# Altium schematic sheet Motion-Sensor-Sheet.SchDoc
size A4; DocumentNumber: 5; SheetNumber: 5; SheetTotal: 8
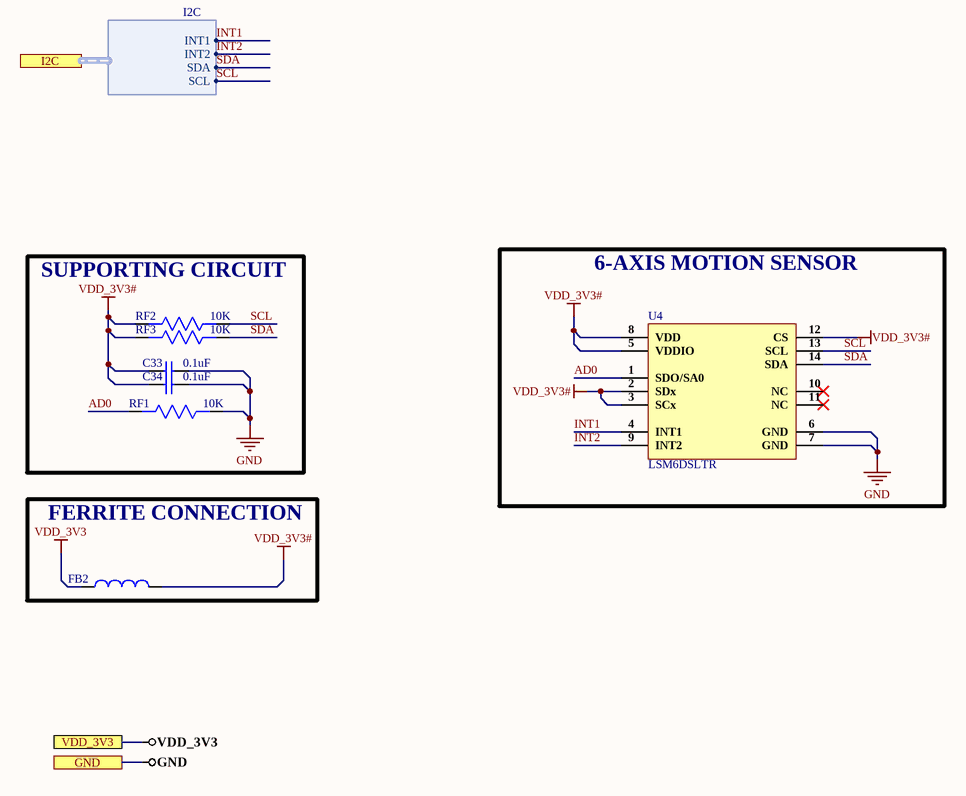
[diagram p0: Motion-Sensor-Sheet.SchDoc]

## Parts
C33  0.1uF  [Cap0603]
C34  0.1uF  [Cap0603]
FB2  MPZ1608S121ATDH5  [MPZ1608S121ATDH5]  (value not drawn)
RF1  10K  [Res0603]
RF2  10K  [Res0603]
RF3  10K  [Res0603]
U4  LSM6DSLTR  [14 LGA (2.5x3)]

## Blocks framed on the sheet
SUPPORTING CIRCUIT: C33 C34 RF1-RF3
6-AXIS MOTION SENSOR: U4
FERRITE CONNECTION: FB2

## Ports
GND, I2C (harness I2C), VDD_3V3

## Harnesses
I2C: INT1, INT2, SDA, SCL

## Nets
GND: C33.2 C34.2 RF1.1 U4.6(GND) U4.7(GND) ; port GND
VDD_3V3: FB2.1 ; port VDD_3V3
VDD_3V3#: C33.1 C34.1 FB2.2 RF2.2 RF3.2 U4.2(SDx) U4.3(SCx) U4.5(VDDIO) U4.8(VDD) U4.12(CS)
AD0: RF1.2 U4.1(SDO/SA0)
INT1: U4.4(INT1) ; port I2C.INT1
INT2: U4.9(INT2) ; port I2C.INT2
SCL: RF2.1 U4.13(SCL) ; port I2C.SCL
SDA: RF3.1 U4.14(SDA) ; port I2C.SDA

Not connected (* = marked no-connect by the designer): U4 10(NC)* 11(NC)*

## Library data of the parts
C33 C34 = CL10B104KB8NNNC: Cap Ceramic 0.1uF 50VDC X7R 10% SMD 0603 Paper T/R; Manufacturer: Samsung; Capacitance: 100nF; Voltage Rating: 50V; Supplier 1: Digi-Key; Manufacturer Part Number: CL10B104KB8NNNC; RoHS: Yes; Category: Ceramic Capacitors; Stock 1: 3998791; Pricing 1: 1=0.10000, 10=0.03000, 50=0.01640, 100=0.01340, 500=0.00954, 1000=0.00750 (USD); Mount: Surface Mount; Case/Package: 0603; Case Code (Metric): 1608; Case Code (Imperial): 0603; Material: Ceramic; Contact Plating: Tin; Min Operating Temperature: -55°C; Max Operating Temperature: 125°C; Dielectric: X7R; Tolerance: 10%; Package Quantity: 1; Packaging: Tape and Reel; Voltage: 50V; Voltage Rating (DC): 50V; Series: CL; Construction: Flat; Length: 1.6mm; Width: 0.031inch; Height: 0.8mm; Depth: 0.8mm; Thickness: 0.035inch; Radiation Hardening: No; Lead Free: Lead Free; RoHS Compliant: Yes; ComponentLink1URL: https://datasheet.ciiva.com/25803/cl10b104kb8nnnc-25803393.pdf?src-supplier=Digi-Key; ComponentLink1Description: https://datasheet.ciiva.com/25803/cl10b104kb8nnnc-25803393.pdf?src-supplier=Digi-Key; ComponentLink2URL: https://datasheet.ciiva.com/26838/getdatasheetpartid-89097-26838411.pdf?src-supplier=Verical; ComponentLink2Description: https://datasheet.ciiva.com/26838/getdatasheetpartid-89097-26838411.pdf?src-supplier=Verical; ComponentLink3URL: https://datasheet.ciiva.com/29198/456651-da-01-en-vs-kondensator-0605-29198839.pdf?src-supplier=Conrad; ComponentLink3Description: https://datasheet.ciiva.com/29198/456651-da-01-en-vs-kondensator-0605-29198839.pdf?src-supplier=Conrad; Supplier Part Number 1: 1276-1000-1-ND
FB2 = MPZ1608S121ATDH5: Ferrite Beads Multi-Layer 120Ohm 25% 100MHz 2A 45mOhm DCR 0603 Automotive T/R; Manufacturer: TDK; Number of Lines: 1; DC Resistance (DCR): 45mR; Impedance: 120R; Supplier 1: Digi-Key; Manufacturer Part Number: MPZ1608S121ATDH5; RoHS: Yes; Category: Ferrite Beads and Chips; Pricing 1: 1=0.11000, 10=0.08600, 25=0.07720, 50=0.05660, 100=0.04890, 250=0.03860, 500=0.03260, 1000=0.02746 (USD); Mount: Surface Mount; Case/Package: 0603; Case Code (Metric): 1608; Case Code (Imperial): 0603; Weight: 7.1E-05oz; Min Operating Temperature: -55°C; Max Operating Temperature: 125°C; Package Quantity: 4000; Packaging: Tape and Reel; Max Current Rating: 2A; Termination: SMD/SMT; Max DC Current: 2A; Tolerance: 25%; Test Frequency: 100MHz; Length: 0.063inch; Width: 0.031inch; Height: 0.03inch; Ratings: AEC-Q200; RoHS Compliant: Yes; ComponentLink1URL: https://media.digikey.com/pdf/Data%20Sheets/TDK%20PDFs/MPZ_Series_Br.pdf?src-supplier=Digi-Key; ComponentLink1Description: https://media.digikey.com/pdf/Data%20Sheets/TDK%20PDFs/MPZ_Series_Br.pdf?src-supplier=Digi-Key; ComponentLink2URL: http://www.mouser.com/ds/2/400/eads_commercial_power_mpz1608_en-923650.pdf?src-supplier=Mouser; ComponentLink2Description: http://www.mouser.com/ds/2/400/eads_commercial_power_mpz1608_en-923650.pdf?src-supplier=Mouser; ComponentLink3URL: https://product.tdk.com/info/en/catalog/datasheets/beads_automotive_power_mpz1608_en.pdf?src-supplier=Digi-Key; ComponentLink3Description: https://product.tdk.com/info/en/catalog/datasheets/beads_automotive_power_mpz1608_en.pdf?src-supplier=Digi-Key; Supplier Part Number 1: 445-172891-6-ND
RF1-RF3 = RC0603FR-0710KL: RES SMD 10K Ohm 1% 1/10W 0603; Manufacturer: Yageo; Resistance: 10kR; Temperature Coefficient: 100ppm/°C; Voltage Rating (DC): 50V; Power Rating: 100mW; Voltage Rating: 75V; Supplier 1: Digi-Key; Manufacturer Part Number: RC0603FR-0710KL; RoHS: Yes; Category: Chip SMD Resistors; Stock 1: 25249139; Pricing 1: 1=0.10000, 10=0.02400, 100=0.00970, 1000=0.00436, 2500=0.00378 (USD); Case/Package: 0603; Number of Pins: 2; Case Code (Imperial): 0603; Case Code (Metric): 1608; Weight: 7.1E-05oz; Size Code: 0603; Min Operating Temperature: -55°C; Max Operating Temperature: 155°C; Tolerance: 1%; Resistor Type: Thick Film; Packaging: Tape and Reel; Termination: SMD/SMT; Features: Moisture Resistant; Series: RC; Max Power Dissipation: 100mW; Number of Terminations: 2; Resistance Tolerance: 1%; Construction: Rectangular; Length: 1.6mm; Width: 0.8mm; Height: 0.45mm; Depth: 0.8mm; Lead Pitch: 0.3mm; REACH SVHC: Unknown; Lead Free: Lead Free; Military Standard: Not; RoHS Compliant: Yes; ComponentLink1URL: https://datasheet.ciiva.com/7660/38590-7660789.pdf?src-supplier=Element14; ComponentLink1Description: https://datasheet.ciiva.com/7660/38590-7660789.pdf?src-supplier=Element14; ComponentLink2URL: https://datasheet.ciiva.com/7983/443971-7983596.pdf?src-supplier=Element14; ComponentLink2Description: https://datasheet.ciiva.com/7983/443971-7983596.pdf?src-supplier=Element14; ComponentLink3URL: https://datasheet.ciiva.com/22747/443971-22747519.pdf?src-supplier=Element14; ComponentLink3Description: https://datasheet.ciiva.com/22747/443971-22747519.pdf?src-supplier=Element14; ComponentLink4URL: https://datasheet.ciiva.com/46440/1868787-46440891.pdf?src-supplier=Element14; ComponentLink4Description: https://datasheet.ciiva.com/46440/1868787-46440891.pdf?src-supplier=Element14; ComponentLink5URL: https://datasheet.ciiva.com/7746/1738695-7746239.pdf?src-supplier=Element14; ComponentLink5Description: https://datasheet.ciiva.com/7746/1738695-7746239.pdf?src-supplier=Element14; ComponentLink6URL: https://datasheet.ciiva.com/15189/getdatasheetpartid-409289-15189591.pdf?src-supplier=Verical; ComponentLink6Description: https://datasheet.ciiva.com/15189/getdatasheetpartid-409289-15189591.pdf?src-supplier=Verical; Supplier Part Number 1: 311-10.0KHRCT-ND
U4 = LSM6DSLTR: IMUACCEL/GYROI2C/SPI14LGA; Manufacturer: STMicroelectronics; Sensor Type: Accelerometer,Gyroscope,3 Axis,Temperature; Output Type: SPI,I2C; Item Type: IC; Supplier 1: Digi-Key; Manufacturer Part Number: LSM6DSLTR; RoHS: Yes; Category: Inertial Measurement Units (IMUs); Stock 1: 17790; Pricing 1: 1=6.37000, 10=5.72400, 25=5.41120, 100=4.68960, 250=4.44912, 500=3.99218, 1000=3.97040 (USD); Mount: Surface Mount; Case/Package: LGA; Min Operating Temperature: -40°C; Max Operating Temperature: 85°C; Packaging: Tape and Reel; RoHS Compliant: Yes; ComponentLink1URL: http://www.farnell.com/datasheets/2290668.pdf?src-supplier=Farnell; ComponentLink1Description: http://www.farnell.com/datasheets/2290668.pdf?src-supplier=Farnell; ComponentLink2URL: https://www.mouser.com/ds/2/389/lsm6dsl-973708.pdf?src-supplier=Mouser; ComponentLink2Description: https://www.mouser.com/ds/2/389/lsm6dsl-973708.pdf?src-supplier=Mouser; ComponentLink3URL: http://www.farnell.com/datasheets/2290668.pdf?src-supplier=Newark; ComponentLink3Description: http://www.farnell.com/datasheets/2290668.pdf?src-supplier=Newark; ComponentLink4URL: http://www.farnell.com/datasheets/2290668.pdf?src-supplier=Element14; ComponentLink4Description: http://www.farnell.com/datasheets/2290668.pdf?src-supplier=Element14; ComponentLink5URL: http://www.st.com/content/ccc/resource/technical/document/datasheet/ee/23/a0/dc/1d/68/45/52/DM00237456.pdf/files/DM00237456.pdf/jcr:content/translations/en.DM00237456.pdf?src-supplier=Digi-Key; ComponentLink5Description: http://www.st.com/content/ccc/resource/technical/document/datasheet/ee/23/a0/dc/1d/68/45/52/DM00237456.pdf/files/DM00237456.pdf/jcr:content/translations/en.DM00237456.pdf?src-supplier=Digi-Key; LCSC Part Number: C126672; Supplier Part Number 1: 497-16705-1-ND